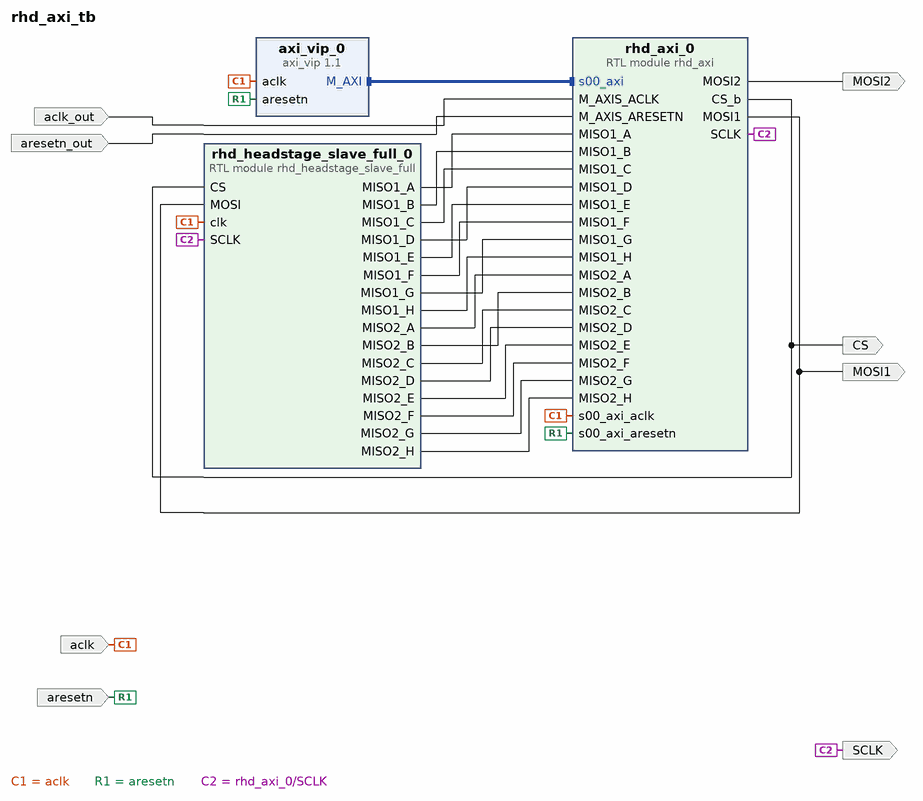
[diagram p0: block diagram of the top level]
# Vivado block design rhd_axi_tb, xck26-sfvc784-2LVI-i, Vivado 2023.1
create_bd_design rhd_axi_tb

create_bd_port -dir I -type clk aclk
set_property -dict {CONFIG.FREQ_HZ 100000000} [get_bd_ports aclk]
create_bd_port -dir I -type rst aresetn
create_bd_port -dir I -type clk aclk_out
set_property -dict {CONFIG.FREQ_HZ 100000000} [get_bd_ports aclk_out]
create_bd_port -dir I -type rst aresetn_out
create_bd_port -dir O CS
create_bd_port -dir O SCLK
create_bd_port -dir O MOSI1
create_bd_port -dir O MOSI2

create_bd_cell -type module -reference rhd_axi rhd_axi_0
create_bd_cell -type ip -vlnv xilinx.com:ip:axi_vip:1.1 axi_vip_0
set_property -dict [list \
  CONFIG.ADDR_WIDTH 32 \
  CONFIG.DATA_WIDTH 32 \
  CONFIG.HAS_BRESP 1 \
  CONFIG.HAS_PROT 1 \
  CONFIG.HAS_RRESP 1 \
  CONFIG.HAS_WSTRB 1 \
  CONFIG.INTERFACE_MODE MASTER \
  CONFIG.PROTOCOL AXI4LITE \
  CONFIG.READ_WRITE_MODE READ_WRITE \
] [get_bd_cells axi_vip_0]
create_bd_cell -type module -reference rhd_headstage_slave_full rhd_headstage_slave_full_0

# ---- connections ----

connect_bd_intf_net [get_bd_intf_pins axi_vip_0/M_AXI] [get_bd_intf_pins rhd_axi_0/s00_axi]
connect_bd_net [get_bd_ports aclk] [get_bd_pins axi_vip_0/aclk] [get_bd_pins rhd_axi_0/s00_axi_aclk] [get_bd_pins rhd_headstage_slave_full_0/clk]
connect_bd_net [get_bd_ports aclk_out] [get_bd_pins rhd_axi_0/M_AXIS_ACLK]
connect_bd_net [get_bd_ports aresetn] [get_bd_pins axi_vip_0/aresetn] [get_bd_pins rhd_axi_0/s00_axi_aresetn]
connect_bd_net [get_bd_ports aresetn_out] [get_bd_pins rhd_axi_0/M_AXIS_ARESETN]
connect_bd_net [get_bd_pins rhd_axi_0/CS_b] [get_bd_ports CS] [get_bd_pins rhd_headstage_slave_full_0/CS]
connect_bd_net [get_bd_pins rhd_axi_0/MOSI1] [get_bd_ports MOSI1] [get_bd_pins rhd_headstage_slave_full_0/MOSI]
connect_bd_net [get_bd_pins rhd_axi_0/MOSI2] [get_bd_ports MOSI2]
connect_bd_net [get_bd_pins rhd_axi_0/SCLK] [get_bd_ports SCLK] [get_bd_pins rhd_headstage_slave_full_0/SCLK]
connect_bd_net -net rhd_headstage_slave_0_MISO1_A [get_bd_pins rhd_headstage_slave_full_0/MISO1_A] [get_bd_pins rhd_axi_0/MISO1_A]
connect_bd_net -net rhd_headstage_slave_0_MISO1_B [get_bd_pins rhd_headstage_slave_full_0/MISO1_B] [get_bd_pins rhd_axi_0/MISO1_B]
connect_bd_net -net rhd_headstage_slave_0_MISO1_C [get_bd_pins rhd_headstage_slave_full_0/MISO1_C] [get_bd_pins rhd_axi_0/MISO1_C]
connect_bd_net -net rhd_headstage_slave_0_MISO1_D [get_bd_pins rhd_headstage_slave_full_0/MISO1_D] [get_bd_pins rhd_axi_0/MISO1_D]
connect_bd_net -net rhd_headstage_slave_0_MISO1_E [get_bd_pins rhd_headstage_slave_full_0/MISO1_E] [get_bd_pins rhd_axi_0/MISO1_E]
connect_bd_net -net rhd_headstage_slave_0_MISO1_F [get_bd_pins rhd_headstage_slave_full_0/MISO1_F] [get_bd_pins rhd_axi_0/MISO1_F]
connect_bd_net -net rhd_headstage_slave_0_MISO1_G [get_bd_pins rhd_headstage_slave_full_0/MISO1_G] [get_bd_pins rhd_axi_0/MISO1_G]
connect_bd_net -net rhd_headstage_slave_0_MISO1_H [get_bd_pins rhd_headstage_slave_full_0/MISO1_H] [get_bd_pins rhd_axi_0/MISO1_H]
connect_bd_net -net rhd_headstage_slave_0_MISO2_A [get_bd_pins rhd_headstage_slave_full_0/MISO2_A] [get_bd_pins rhd_axi_0/MISO2_A]
connect_bd_net -net rhd_headstage_slave_0_MISO2_B [get_bd_pins rhd_headstage_slave_full_0/MISO2_B] [get_bd_pins rhd_axi_0/MISO2_B]
connect_bd_net -net rhd_headstage_slave_0_MISO2_C [get_bd_pins rhd_headstage_slave_full_0/MISO2_C] [get_bd_pins rhd_axi_0/MISO2_C]
connect_bd_net -net rhd_headstage_slave_0_MISO2_D [get_bd_pins rhd_headstage_slave_full_0/MISO2_D] [get_bd_pins rhd_axi_0/MISO2_D]
connect_bd_net -net rhd_headstage_slave_0_MISO2_E [get_bd_pins rhd_headstage_slave_full_0/MISO2_E] [get_bd_pins rhd_axi_0/MISO2_E]
connect_bd_net -net rhd_headstage_slave_0_MISO2_F [get_bd_pins rhd_headstage_slave_full_0/MISO2_F] [get_bd_pins rhd_axi_0/MISO2_F]
connect_bd_net -net rhd_headstage_slave_0_MISO2_G [get_bd_pins rhd_headstage_slave_full_0/MISO2_G] [get_bd_pins rhd_axi_0/MISO2_G]
connect_bd_net -net rhd_headstage_slave_0_MISO2_H [get_bd_pins rhd_headstage_slave_full_0/MISO2_H] [get_bd_pins rhd_axi_0/MISO2_H]

validate_bd_design
save_bd_design
